# EasyEDA Pro project ProDoc_Schematic1_2026-04-23.epro

# Schematic Schematic1
Board Name: Board1; Create Date: 2026-03-13; Page Name: P1; Project Name: wrist_watch; Schematic Name: Schematic1; Update Date: 2026-04-13; Company: EasyEDA.com; Page Size: A4; Version: V1.0
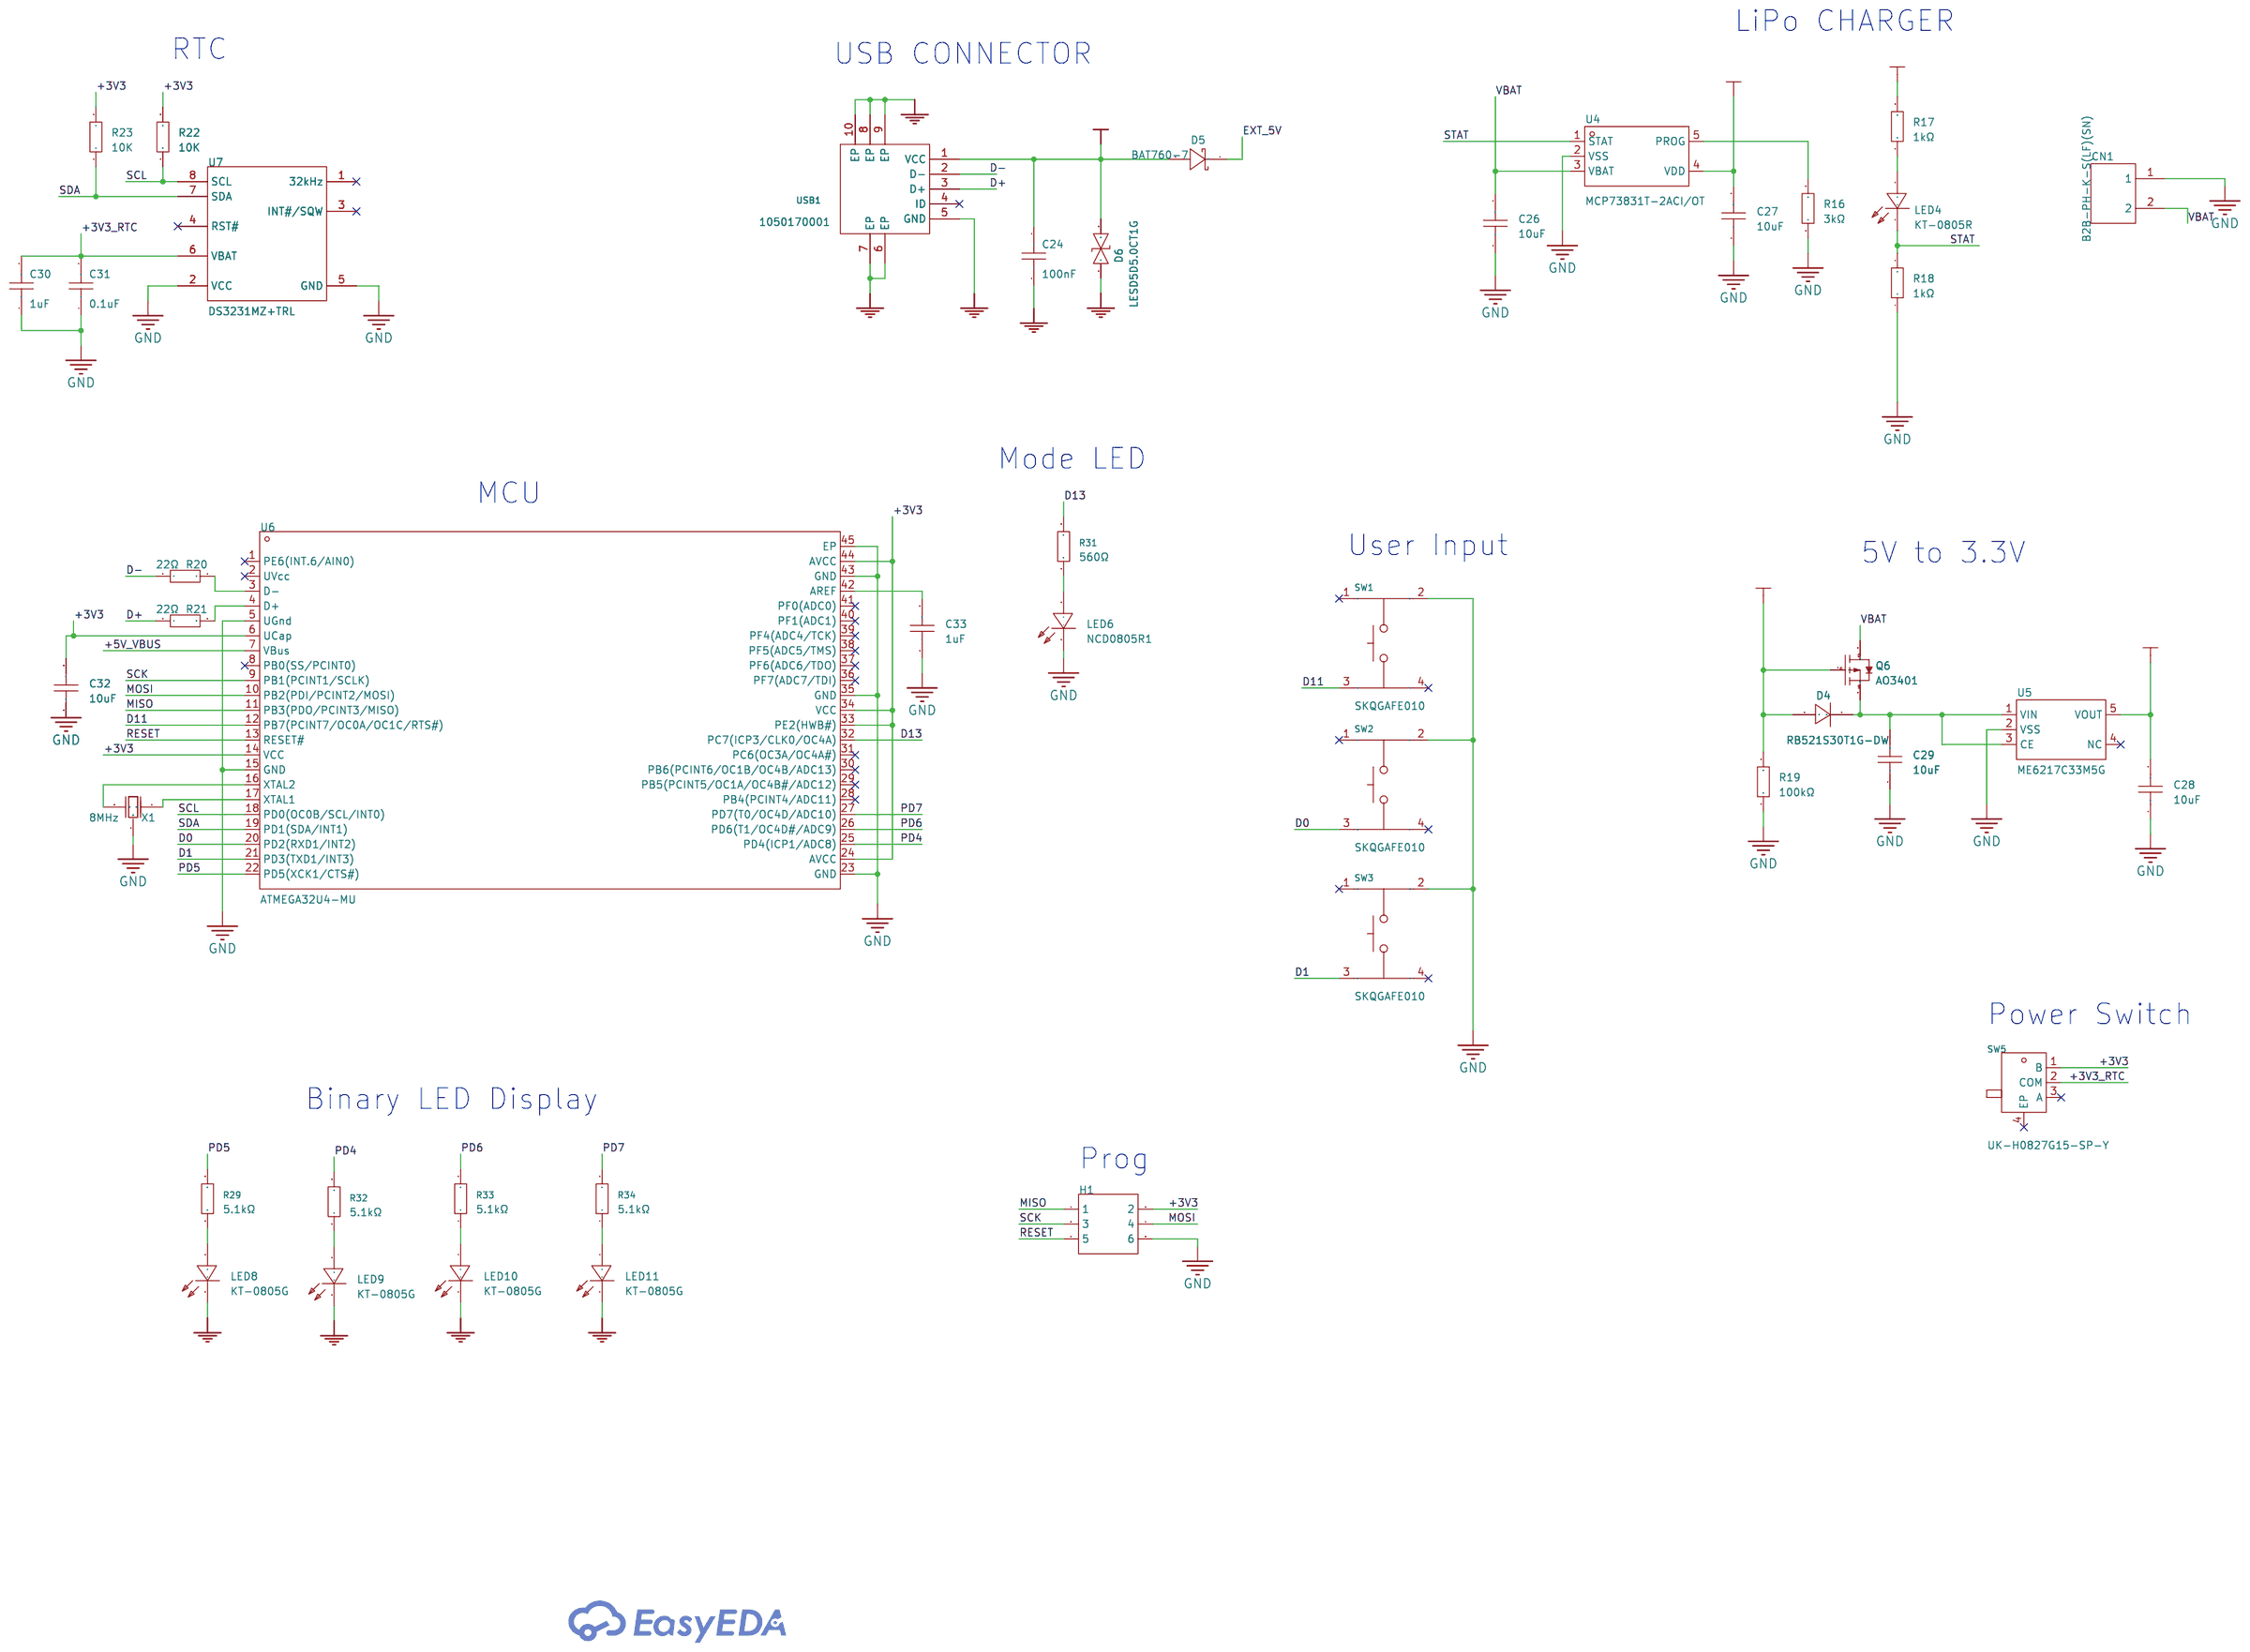
[diagram p0: schematic sheet]

## Parts
C24  100nF  [C0402]
C26  10uF  [C0402]
C27  10uF  [C0402]
C28  10uF  [C0402]
C29  10uF  [C0402]
C30  1uF  [C0402]
C31  0.1uF  [C0402]
C32  10uF  [C0402]
C33  1uF  [C0402]
CN1  B2B-PH-K-S(LF)(SN)  [CONN-TH_B2B-PH-K-S]
D4  RB521S30T1G-DW  [SOD-523_L1.2-W0.8-LS1.6-RD]
D5  BAT760-7  [SOD-323_L1.7-W1.3-LS2.6-FD-1]
D6  LESD5D5.0CT1G  [SOD-523_L1.2-W0.8-LS1.6-BI]
H1  -  [HDR-TH_6P-P2.54-V-F-R2-C3-S2.54]
LED4  KT-0805R  [LED0805-R-RD]
LED6  NCD0805R1  [LED0805-R-RD]
LED8  KT-0805G  [LED0805-R-RD]
LED9  KT-0805G  [LED0805-R-RD]
LED10  KT-0805G  [LED0805-R-RD]
LED11  KT-0805G  [LED0805-R-RD]
Q6  AO3401  [SOT-23-3_L2.9-W1.3-P0.95-LS2.4-BR]
R16  3kΩ  [R0603]
R17  1kΩ  [R0603]
R18  1kΩ  [R0603]
R19  100kΩ  [R0603]
R20  22Ω  [R0603]
R21  22Ω  [R0603]
R22  10K  [R0603]
R23  10K  [R0603]
R29  5.1kΩ  [R0402]
R31  560Ω  [R0402]
R32  5.1kΩ  [R0402]
R33  5.1kΩ  [R0402]
R34  5.1kΩ  [R0402]
SW1  SKQGAFE010  [SW-SMD_4P-L5.2-W5.2-P3.70-LS6.4]
SW2  SKQGAFE010  [SW-SMD_4P-L5.2-W5.2-P3.70-LS6.4]
SW3  SKQGAFE010  [SW-SMD_4P-L5.2-W5.2-P3.70-LS6.4]
SW5  UK-H0827G15-SP-Y  [SW-SMD_UK-H0827G15-SP-Y]
U4  MCP73831T-2ACI/OT  [SOT-23-5_L3.0-W1.7-P0.95-LS2.8-BL]
U5  ME6217C33M5G  [SOT-23-5_L3.0-W1.7-P0.95-LS2.8-BR]
U6  ATMEGA32U4-MU  [VQFN-44_L7.0-W7.0-P0.50-BL-EP5.2]
U7  DS3231MZ+TRL  [SOIC-8_L4.9-W3.9-P1.27-LS6.0-BL]
USB1  1050170001  [MICRO-USB-SMD_105017-0001]
X1  8MHz  [OSC-SMD_3P-L3.2-W1.3-P1.20-L]

## Library data of the parts
C24 C30 C31 = CL05B104KO5NNNC: Capacitance:100nF Tolerance:±10% Tolerance:±10% Voltage Rating:16V Temperature Coefficient:X7R; LCSC Part Name: 100nF ±10% 16V; Supplier Part: C1525; Manufacturer: SAMSUNG(三星); Supplier Footprint: 0402; JLCPCB Part Class: Basic Part; Datasheet: https://item.szlcsc.com/datasheet/CL05B104KO5NNNC/1877.html; Supplier: LCSC; Tolerance: ±10%; Voltage Rating: 16V; Temperature Coefficient: X7R
C26-C29 C32 C33 = CL05A106MP5NUNC_C315248: Capacitance:10uF Tolerance:±20% Tolerance:±20% Voltage Rating:10V Temperature Coefficient:X5R; LCSC Part Name: 10uF ±20% 10V; Supplier Part: C315248; Manufacturer: SAMSUNG(三星); Manufacturer Part: CL05A106MP5NUNC; Supplier Footprint: 0402; JLCPCB Part Class: Extended Part; Datasheet: https://item.szlcsc.com/datasheet/CL05A106MP5NUNC/297154.html; Supplier: LCSC; Tolerance: ±20%; Voltage Rating: 10V; Temperature Coefficient: X5R
CN1 = B2B-PH-K-S(LF)(SN): Pins Structure:1x2P Pitch:2mm Mounting Type:Direct Insert Reference Series:PH Number of Pins:2P Number of Rows:1 Number of PINs Per Row:2 Row Spacing:- Current Rating:2A Contact Material:Brass Contact Plating:Tin Operating Temperature:-25℃~+85℃ Operating; LCSC Part Name: 1x2P 间距:2mm 直插 系列:PH; Supplier Part: C131337; Manufacturer: JST; Supplier Footprint: 插件,P=2mm; JLCPCB Part Class: Extended Part; Datasheet: https://atta.szlcsc.com/upload/public/pdf/source/20171026/C131342_15089839687311058815.pdf; Supplier: LCSC; Pins Structure: 1x2P; Pitch: 2mm; Mounting Type: Direct Insert; Reference Series: PH; Number of Pins: 2P; Number of Rows: 1; Number of PINs Per Row: 2; Current Rating: 2A; Contact Material: Brass; Contact Plating: Tin; Operating Temperature: -25℃~+85℃; Voltage Rating: 100V; Plastic Material: PA66; Flame Retardant Rating: UL94V-0; Supplementary Features: K-leg punch; Color: White; Z-Height of the Board: 6mm; X-Length of Bottom Edge on Board (Spacing Line): 5.9mm; Y-Width of Bottom Edge on Board: 4.5mm
D4 = RB521S30T1G_C27636108: Diode Configuration:1 Independent Voltage - Forward(Vf@If):500mV@200mA Voltage - DC Reverse(Vr):30V Current - Rectified:200mA Reverse Leakage Current (Ir):30uA@10V Non-Repetitive Peak Forward Surge Current:1A; LCSC Part Name: 电压:30V 电流:0.2A; Supplier Part: C27636108; Manufacturer: DOWO(东沃); Supplier Footprint: SOD-523; JLCPCB Part Class: Extended Part; Datasheet: https://item.szlcsc.com/datasheet/RB521S30T1G-DW/29373143.html; Supplier: LCSC; Diode Configuration: 1 Independent; Voltage - Forward(Vf@If): 500mV@200mA; Voltage - DC Reverse(Vr): 30V; Current - Rectified: 200mA; Reverse Leakage Current (Ir): 30uA@10V; Non-Repetitive Peak Forward Surge Current: 1A
D5 = BAT760-7_C27636120: Voltage - Forward(Vf@If):875mV@3.0A Voltage - DC Reverse(Vr):30V Current - Rectified:1A Reverse Leakage Current (Ir):1mA@30V Non-Repetitive Peak Forward Surge Current:9A; Supplier Part: C27636120; Manufacturer: DOWO(东沃); Supplier Footprint: SOD-323; JLCPCB Part Class: Extended Part; Datasheet: https://item.szlcsc.com/datasheet/BAT760-7/29373155.html; Supplier: LCSC; Voltage - Forward(Vf@If): 875mV@3.0A; Voltage - DC Reverse(Vr): 30V; Current - Rectified: 1A; Reverse Leakage Current (Ir): 1mA@30V; Non-Repetitive Peak Forward Surge Current: 9A
D6 = LESD5D5.0CT1G: Polarity:Bidirectional Reverse Stand-Off Voltage (Vrwm):5V Clamping Voltage:18.6V Peak Pulse Current (Ipp):9.4A@8/20us Peak Pulse Power Dissipation (Ppp):150W@8/20us Voltage - Breakdown:7.8V Reverse Leakage Current (Ir):1uA Operating Temperature:-40℃~+125; LCSC Part Name: 双向ESD; Supplier Part: C383211; Manufacturer: LRC(乐山无线电); Supplier Footprint: SOD-523; JLCPCB Part Class: Extended Part; Datasheet: https://item.szlcsc.com/datasheet/LESD5D5.0CT1G/356518.html; Supplier: LCSC; Polarity: Bidirectional; Reverse Stand-Off Voltage (Vrwm): 5V; Clamping Voltage: 18.6V; Peak Pulse Current (Ipp): 9.4A@8/20us; Peak Pulse Power Dissipation (Ppp): 150W@8/20us; Voltage - Breakdown: 7.8V; Reverse Leakage Current (Ir): 1uA; Operating Temperature: -40℃~+125℃; level of protection: IEC 61000-4-4；IEC 61000-4-2; Type: ESD; Junction Capacitance: 15pF
H1 = HDR-F_2.54_2x3: Supplier Footprint: Through
LED4 = KT-0805R: LCSC Part Name: 0805 红灯 高亮; Supplier Part: C2295; Manufacturer: KENTO; Supplier Footprint: 0805; JLCPCB Part Class: Extended Part; Supplier: LCSC
LED6 = NCD0805R1_C84256: Lamp Holder Type:- Emitted Color:Red Forward Voltage (VF):1.6V~2.6V Forward Voltage (VF):1.6V~2.6V Power Dissipation:65mW Forward Current:20mA Dominant Wavelength:615nm~630nm Dominant Wavelength:615nm~630nm Peak Wavelength:- Diode Configuration:独立二极管 Lens; Supplier Part: C84256; Manufacturer: 国星光电; Supplier Footprint: 0805; JLCPCB Part Class: Basic Part; Datasheet: https://atta.szlcsc.com/upload/public/pdf/source/20200820/C84256_F0A75A43B3EAD75808600A0514C76B99.pdf; Supplier: LCSC; Emitted Color: Red; Forward Voltage (VF): 1.6V~2.6V; Power Dissipation: 65mW; Forward Current: 20mA; Dominant Wavelength: 615nm~630nm; Diode Configuration: 独立二极管; Lens Color: 无色透明透镜; Luminous Intensity: 67mcd~195mcd; Viewing Angle: 130°; Operating Temperature: -30℃~+85℃
LED8-LED11 = KT-0805G: Lamp Holder Type:- Emitted Color:Emerald Forward Voltage (VF):- Forward Voltage (VF):- Power Dissipation:- Forward Current:- Dominant Wavelength:- Dominant Wavelength:- Peak Wavelength:- Diode Configuration:- Lens Color:- Color Temperature:- Color Tempera; LCSC Part Name: 0805 翠绿 高亮; Supplier Part: C2297; Manufacturer: KENTO; Supplier Footprint: 0805; JLCPCB Part Class: Basic Part; Datasheet: https://atta.szlcsc.com/upload/public/pdf/source/20170209/1486607340485.pdf; Supplier: LCSC; Emitted Color: Emerald
Q6 = AO3401_C2985640: Type:1 piece P-channel Drain to Source Voltage:30V Current - Continuous Drain(Id): RDS(on):60mΩ@10V Pd - Power Dissipation:1.4W Gate Threshold Voltage (Vgs(th)@Id):600mV Gate Charge(Qg):14nC@10V Input Capacitance(Ciss@Vds):645pF Reverse Transfer Capacitan; LCSC Part Name: P沟道,电流:-4.1A,耐压:-30V; Supplier Part: C2985640; Manufacturer: KUU; Supplier Footprint: SOT-23; JLCPCB Part Class: Extended Part; Datasheet: https://atta.szlcsc.com/upload/public/pdf/source/20220328/37BE275F20EB9DF71D2647772B9E905B.pdf; Supplier: LCSC; Type: 1 piece P-channel; Drain to Source Voltage: 30V; RDS(on): 60mΩ@10V; Pd - Power Dissipation: 1.4W; Gate Threshold Voltage (Vgs(th)@Id): 600mV; Gate Charge(Qg): 14nC@10V; Input Capacitance(Ciss@Vds): 645pF; Reverse Transfer Capacitance (Crss@Vds): 55pF; Operating Temperature: -55℃~+150℃
R16 = 0603WAF3001T5E: Type:Thick Film Resistor Resistance:3kΩ Tolerance:±1% Tolerance:±1% Power(Watts):100mW Voltage-Supply(Max):75V Temperature Coefficient:±100ppm/℃ Temperature Coefficient:±100ppm/℃ Operating Temperature:-55℃~+155℃ Operating Temperature:-55℃~+155℃; LCSC Part Name: 3kΩ ±1% 100mW 厚膜电阻; Supplier Part: C4211; Manufacturer: UNI-ROYAL(厚声); Supplier Footprint: 0603; JLCPCB Part Class: Basic Part; Datasheet: https://item.szlcsc.com/datasheet/0603WAF3001T5E/4618.html; Supplier: LCSC; Type: Thick Film Resistor; Tolerance: ±1%; Power(Watts): 100mW; Voltage-Supply(Max): 75V; Temperature Coefficient: ±100ppm/℃; Operating Temperature: -55℃~+155℃
R17 R18 = RC0603FR-071KL: Type:Thick Film Resistor Resistance:1kΩ Tolerance:±1% Tolerance:±1% Power(Watts):100mW Voltage-Supply(Max):75V Temperature Coefficient:±100ppm/℃ Temperature Coefficient:±100ppm/℃ Operating Temperature:-55℃~+155℃ Operating Temperature:-55℃~+155℃; LCSC Part Name: 厚膜电阻 1kΩ ±1% 100mW; Supplier Part: C22548; Manufacturer: YAGEO(国巨); Supplier Footprint: 0603; JLCPCB Part Class: Extended Part; Datasheet: https://atta.szlcsc.com/upload/public/pdf/source/20180316/70C0E2BDAE7FCC62C531A5A58D202EE1.pdf; Supplier: LCSC; Type: Thick Film Resistors; Tolerance: ±1%; Power(Watts): 100mW; Voltage-Supply(Max): 75V; Temperature Coefficient: ±100ppm/℃; Operating Temperature: -55℃~+155℃
R19-R21 = 0603WAF1003T5E: Type:Thick Film Resistor Resistance:100kΩ Tolerance:±1% Tolerance:±1% Power(Watts):100mW Voltage-Supply(Max):75V Temperature Coefficient:±100ppm/℃ Temperature Coefficient:±100ppm/℃ Operating Temperature:-55℃~+155℃ Operating Temperature:-55℃~+155℃; LCSC Part Name: 100kΩ ±1% 100mW 厚膜电阻; Supplier Part: C25803; Manufacturer: UNI-ROYAL(厚声); Supplier Footprint: 0603; JLCPCB Part Class: Basic Part; Datasheet: https://item.szlcsc.com/datasheet/0603WAF1003T5E/26546.html; Supplier: LCSC; Type: Thick Film Resistor; Tolerance: ±1%; Power(Watts): 100mW; Voltage-Supply(Max): 75V; Temperature Coefficient: ±100ppm/℃; Operating Temperature: -55℃~+155℃
R22 R23 = Res_0603: Supplier Footprint: 0603
R29 R32-R34 = 0402WGF5101TCE: Type:Thick Film Resistor Resistance:5.1kΩ Tolerance:±1% Tolerance:±1% Power(Watts):62.5mW Voltage-Supply(Max):50V Temperature Coefficient:±100ppm/℃ Temperature Coefficient:±100ppm/℃ Operating Temperature:-55℃~+155℃ Operating Temperature:-55℃~+155℃; LCSC Part Name: 5.1kΩ ±1% 62.5mW 厚膜电阻; Supplier Part: C25905; Manufacturer: UNI-ROYAL(厚声); Supplier Footprint: 0402; JLCPCB Part Class: Basic Part; Datasheet: https://item.szlcsc.com/datasheet/0402WGF5101TCE/26648.html; Supplier: LCSC; Type: Thick Film Resistor; Tolerance: ±1%; Power(Watts): 62.5mW; Voltage-Supply(Max): 50V; Temperature Coefficient: ±100ppm/℃; Operating Temperature: -55℃~+155℃
R31 = 0402WGF5600TCE: Type:Thick Film Resistor Resistance:560Ω Tolerance:±1% Tolerance:±1% Power(Watts):62.5mW Voltage-Supply(Max):50V Temperature Coefficient:±100ppm/℃ Temperature Coefficient:±100ppm/℃ Operating Temperature:-55℃~+155℃ Operating Temperature:-55℃~+155℃; LCSC Part Name: 560Ω ±1% 62.5mW 厚膜电阻; Supplier Part: C25126; Manufacturer: UNI-ROYAL(厚声); Supplier Footprint: 0402; JLCPCB Part Class: Extended Part; Datasheet: https://item.szlcsc.com/datasheet/0402WGF5600TCE/25869.html; Supplier: LCSC; Type: Thick Film Resistor; Tolerance: ±1%; Power(Watts): 62.5mW; Voltage-Supply(Max): 50V; Temperature Coefficient: ±100ppm/℃; Operating Temperature: -55℃~+155℃
SW1-SW3 = SKQGAFE010: Circuit:SPST Actuator Style:Round Button Mounting Style:Brick nogging Switch Length:5.2mm Switch Width:5.2mm Switch Height:1.5mm Contact Current:50mA Voltage Rating (DC):12V With Lamp:- Mechanical Life:-; LCSC Part Name: 5.2*5.2*1.5mm 立贴 轻触开关; Supplier Part: C202424; Manufacturer: ALPSALPINE(阿尔卑斯阿尔派); Supplier Footprint: SMD; JLCPCB Part Class: Extended Part; Datasheet: https://atta.szlcsc.com/upload/public/pdf/source/20180403/C202424_0F2426F717DE6DF50AA1D30BA2DCAA94.pdf; Supplier: LCSC; Circuit: SPST; Actuator Style: Round Button; Mounting Style: Brick nogging; Switch Length: 5.2mm; Switch Width: 5.2mm; Switch Height: 1.5mm; Contact Current: 50mA; Voltage Rating (DC): 12V
SW5 = UK-H0827G15-SP-Y: Current Rating:50mA Voltage Rating:12V Life:10,000 Cycles; LCSC Part Name: 拨动开关6.6x2.6 7脚小拨动侧拨贴片; Supplier Part: C493292; Manufacturer: USAKRO(美韩); Supplier Footprint: SMD; JLCPCB Part Class: Extended Part; Datasheet: https://item.szlcsc.com/datasheet/UK-H0827G15-SP-Y/503948.html; Supplier: LCSC; Current Rating: 50mA; Voltage Rating: 12V; Life: 10,000 Cycles
U4 = MCP73831T-2ACI/OT: The Chip Type:- Voltage - Supply:3.75V~6V Voltage - Supply:3.75V~6V Charge Current - Max:- Charging Saturation Voltage:4.2V Type of Battery:Lithium-ion/Polymer Number of Cells:1 Number of Cells:1 Operating Temperature:-40℃~+85℃ Operating Temperature:-40℃~; Supplier Part: C424093; Manufacturer: MICROCHIP(美国微芯); Supplier Footprint: SOT-23-5; JLCPCB Part Class: Extended Part; Datasheet: https://atta.szlcsc.com/upload/public/pdf/source/20190902/C424093_BB3CBFD6F009A8554318004A07DA97EE.pdf; Supplier: LCSC; Voltage - Supply: 3.75V~6V; Charging Saturation Voltage: 4.2V; Type of Battery: Lithium-ion/Polymer; Number of Cells: 1; Operating Temperature: -40℃~+85℃
U5 = ME6217C33M5G: Output Type:Fixed Voltage - Supply:6.5V Output Voltage:3.3V Output Voltage:3.3V Output Current:800mA Power Supply Rejection Ratio (PSRR):65dB@(1kHz) Voltage Dropout:180mV@(300mA) standby current:100uA Features:Over Temperature Protection；Enable Operating; LCSC Part Name: 输入7V 输出3.3V 800mA; Supplier Part: C427602; Manufacturer: MICRONE(南京微盟); Supplier Footprint: SOT-23-5; JLCPCB Part Class: Extended Part; Datasheet: https://atta.szlcsc.com/upload/public/pdf/source/20190910/C427602_D4B9162A2E9D9EF57C60010DFDECEF37.pdf; Supplier: LCSC; Output Type: Fixed; Voltage - Supply: 6.5V; Output Voltage: 3.3V; Output Current: 800mA; Power Supply Rejection Ratio (PSRR): 65dB@(1kHz); Voltage Dropout: 180mV@(300mA); standby current: 100uA; Features: Over Temperature Protection；Enable; Operating Temperature: -40℃~+85℃; Output Configuration: Positive; Number of Outputs: 1
U6 = ATMEGA32U4-MU: CPU Core:AVR CPU Maximum Speed:16MHz Program Storage Size:32KB Program Memory Type:FLASH Number of I/O:26 ADC (Bit):10bit Voltage - Supply:2.7V~5.5V Voltage - Supply:2.7V~5.5V Applications:-; LCSC Part Name: 带有16/32K字节在系统编程（ISP）闪存和USB控制器的8位微控制器; Supplier Part: C112161; Manufacturer: MICROCHIP(美国微芯); Supplier Footprint: VQFN-44-EP(7x7); JLCPCB Part Class: Extended Part; Datasheet: https://item.szlcsc.com/datasheet/ATMEGA32U4-MU/113393.html; Supplier: LCSC; CPU Core: AVR; CPU Maximum Speed: 16MHz; Program Storage Size: 32KB; Program Memory Type: FLASH; Number of I/O: 26; ADC (Bit): 10bit; Voltage - Supply: 2.7V~5.5V
U7 = DS3231MZ+TRL: Interface:I2C Voltage - Supply:2.3V~5.5V Voltage - Supply:2.3V~5.5V Operating Temperature:-40℃~+85℃ Operating Temperature:-40℃~+85℃; LCSC Part Name: 高精度RTC集成MEMS谐振器; Supplier Part: C107410; Manufacturer: ADI(亚德诺)/MAXIM(美信); Supplier Footprint: SOIC-8; JLCPCB Part Class: Extended Part; Datasheet: https://item.szlcsc.com/datasheet/DS3231MZ%252BTRL/108629.html; Supplier: LCSC; Interface: I2C; Voltage - Supply: 2.3V~5.5V; Operating Temperature: -40℃~+85℃
USB1 = 1050170001: Connector Type:Micro-B Standard:USB 2.0 Gender:Female Number of Ports:1 Number of Contacts:5P Mounting Style:卧贴 Current Rating - Power (Max):- Operating Temperature Range:-30℃~+85℃ Operating Temperature Range:-30℃~+85℃; LCSC Part Name: Micro-B 母 卧贴; Supplier Part: C136000; Manufacturer: MOLEX; Supplier Footprint: SMD; JLCPCB Part Class: Extended Part; Datasheet: https://atta.szlcsc.com/upload/public/pdf/source/20171113/C136000_15105610884381115465.pdf; Supplier: LCSC; Connector Type: Micro-B; Standard: USB 2.0; Gender: Female; Number of Ports: 1; Number of Contacts: 5P; Mounting Style: 卧贴; Operating Temperature Range: -30℃~+85℃
X1 = CSTNE8M00GH5C000R0: Frequency:8MHz Built - in Load Capacitance:33pF Resonant Impedance:40Ω Operating Temperature:-40℃~+125℃ Operating Temperature:-40℃~+125℃; LCSC Part Name: 8MHz ±0.07% 内置负载电容:33pF; Supplier Part: C341525; Manufacturer: muRata(村田); Supplier Footprint: SMD3213-3P; JLCPCB Part Class: Extended Part; Datasheet: https://item.szlcsc.com/datasheet/CSTNE8M00GH5C000R0/318917.html; Supplier: LCSC; Built - in Load Capacitance: 33pF; Resonant Impedance: 40Ω; Operating Temperature: -40℃~+125℃

## Nets
+3V3: C32.2 H1.2 R22.2 R23.2 SW5.1(B) U6.6(UCap) U6.14(VCC) U6.24(AVCC) U6.33(PE2(HWB#)) U6.34(VCC) U6.44(AVCC)
+3V3_RTC: C28.2 C30.2 C31.2 SW5.2(COM) U5.5(VOUT) U7.6(VBAT)
+5V_VBUS: C24.2 D5.2(A) D6.2 U6.7(VBus) USB1.1(VCC)
GND: C24.1 C26.1 C27.1 C28.1 C29.1 C30.1 C31.1 C32.1 C33.1 CN1.1 D6.1 H1.6 LED6.2(-) LED8.2(K) LED9.2(K) LED10.2(K) LED11.2(K) R16.1 R18.1 R19.1 SW1.2 SW2.2 SW3.2 U4.2(VSS) U5.2(VSS) U6.5(UGnd) U6.15(GND) U6.23(GND) U6.35(GND) U6.43(GND) U6.45(EP) U7.2(VCC) U7.5(GND) USB1.5(GND) USB1.6(EP) USB1.7(EP) USB1.8(EP) USB1.9(EP) USB1.10(EP) X1.2(GND)
VBAT: C26.2 CN1.2 Q6.3(D) U4.3(VBAT)
D0: SW2.3 U6.20(PD2(RXD1/INT2))
D1: SW3.3 U6.21(PD3(TXD1/INT3))
D11: SW1.3 U6.12(PB7(PCINT7/OC0A/OC1C/RTS#))
D13: R31.2 U6.32(PC7(ICP3/CLK0/OC4A))
D+: R21.1 USB1.3(D+)
D-: R20.2 USB1.2(D-)
EXT_5V: C27.2 D4.2(A) D5.1(C) Q6.1(G) R17.2 R19.2 U4.4(VDD)
MISO: H1.1 U6.11(PB3(PDO/PCINT3/MISO))
MOSI: H1.4 U6.10(PB2(PDI/PCINT2/MOSI))
PD4: R32.2 U6.25(PD4(ICP1/ADC8))
PD5: R29.2 U6.22(PD5(XCK1/CTS#))
PD6: R33.2 U6.26(PD6(T1/OC4D#/ADC9))
PD7: R34.2 U6.27(PD7(T0/OC4D/ADC10))
RESET: H1.5 U6.13(RESET#)
SCK: H1.3 U6.9(PB1(PCINT1/SCLK))
SCL: R22.1 U6.18(PD0(OC0B/SCL/INT0)) U7.8(SCL)
SDA: R23.1 U6.19(PD1(SDA/INT1)) U7.7(SDA)
STAT: LED4.2(K) R18.2 U4.1(STAT)
Net-(C29-2): C29.2 D4.1(C) Q6.2(S) U5.1(VIN) U5.3(CE)
Net-(C33-2): C33.2 U6.42(AREF)
Net-(LED4-1): LED4.1(A) R17.1
Net-(LED6-1): LED6.1(+) R31.1
Net-(LED8-1): LED8.1(A) R29.1
Net-(LED9-1): LED9.1(A) R32.1
Net-(LED10-1): LED10.1(A) R33.1
Net-(LED11-1): LED11.1(A) R34.1
Net-(R16-2): R16.2 U4.5(PROG)
Net-(R20-1): R20.1 U6.3(D-)
Net-(R21-2): R21.2 U6.4(D+)
Net-(U6-16): U6.16(XTAL2) X1.3(OSC2)
Net-(U6-17): U6.17(XTAL1) X1.1(OSC1)

Not connected (* = marked no-connect by the designer): SW1 1* 4*; SW2 1* 4*; SW3 1* 4*; SW5 3(A)* 4(EP)*; U5 4(NC)*; U6 1(PE6(INT.6/AIN0))* 2(UVcc)* 8(PB0(SS/PCINT0))* 28(PB4(PCINT4/ADC11))* 29(PB5(PCINT5/OC1A/OC4B#/ADC12))* 30(PB6(PCINT6/OC1B/OC4B/ADC13))* 31(PC6(OC3A/OC4A#))* 36(PF7(ADC7/TDI))* 37(PF6(ADC6/TDO))* 38(PF5(ADC5/TMS))* 39(PF4(ADC4/TCK))* 40(PF1(ADC1))* 41(PF0(ADC0))*; U7 1(32kHz)* 3(INT#/SQW)* 4(RST#)*; USB1 4(ID)*

## Notes on the sheet
- LiPo CHARGER
- RTC
- USB CONNECTOR
- Mode LED
- MCU
- User Input
- 5V to 3.3V
- Power Switch
- Binary LED Display
- Prog
